# Altium schematic sheet main.SchDoc
size A4
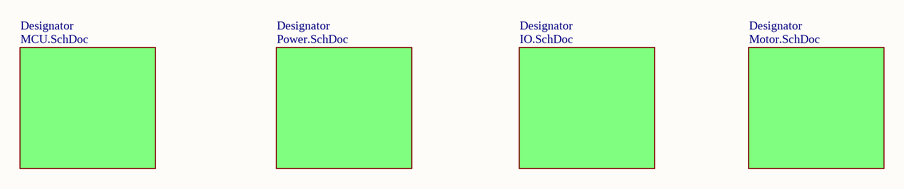
[diagram p0: main.SchDoc]

## Sub-sheets
Designator = MCU.SchDoc: no entries
Designator = Power.SchDoc: no entries
Designator = IO.SchDoc: no entries
Designator = Motor.SchDoc: no entries